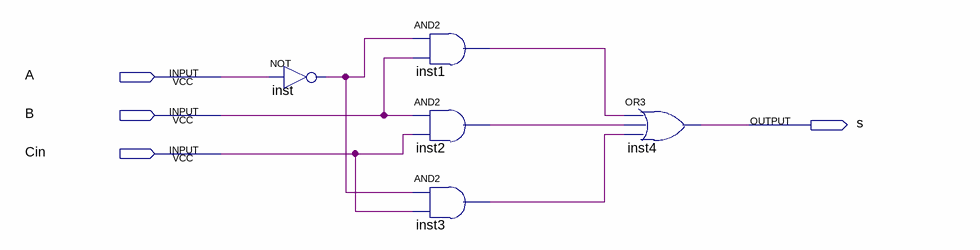
[diagram p0: schematic sheet]
// Quartus schematic Maior_que_bit_a_bit_sinal.bdf as structural Verilog: 5 symbols, 4 pins
module Maior_que_bit_a_bit_sinal (
  input  A,
  input  B,
  input  Cin,
  output s
);

  wire inst1_out, inst2_out, inst3_out, inst_out;

  not inst (inst_out, A);
  and inst1 (inst1_out, inst_out, B);
  and inst2 (inst2_out, B, Cin);
  and inst3 (inst3_out, inst_out, Cin);
  or inst4 (s, inst1_out, inst2_out, inst3_out);
endmodule
